# Altium project SVPXFMC_Carrier_6U.PrjPcb
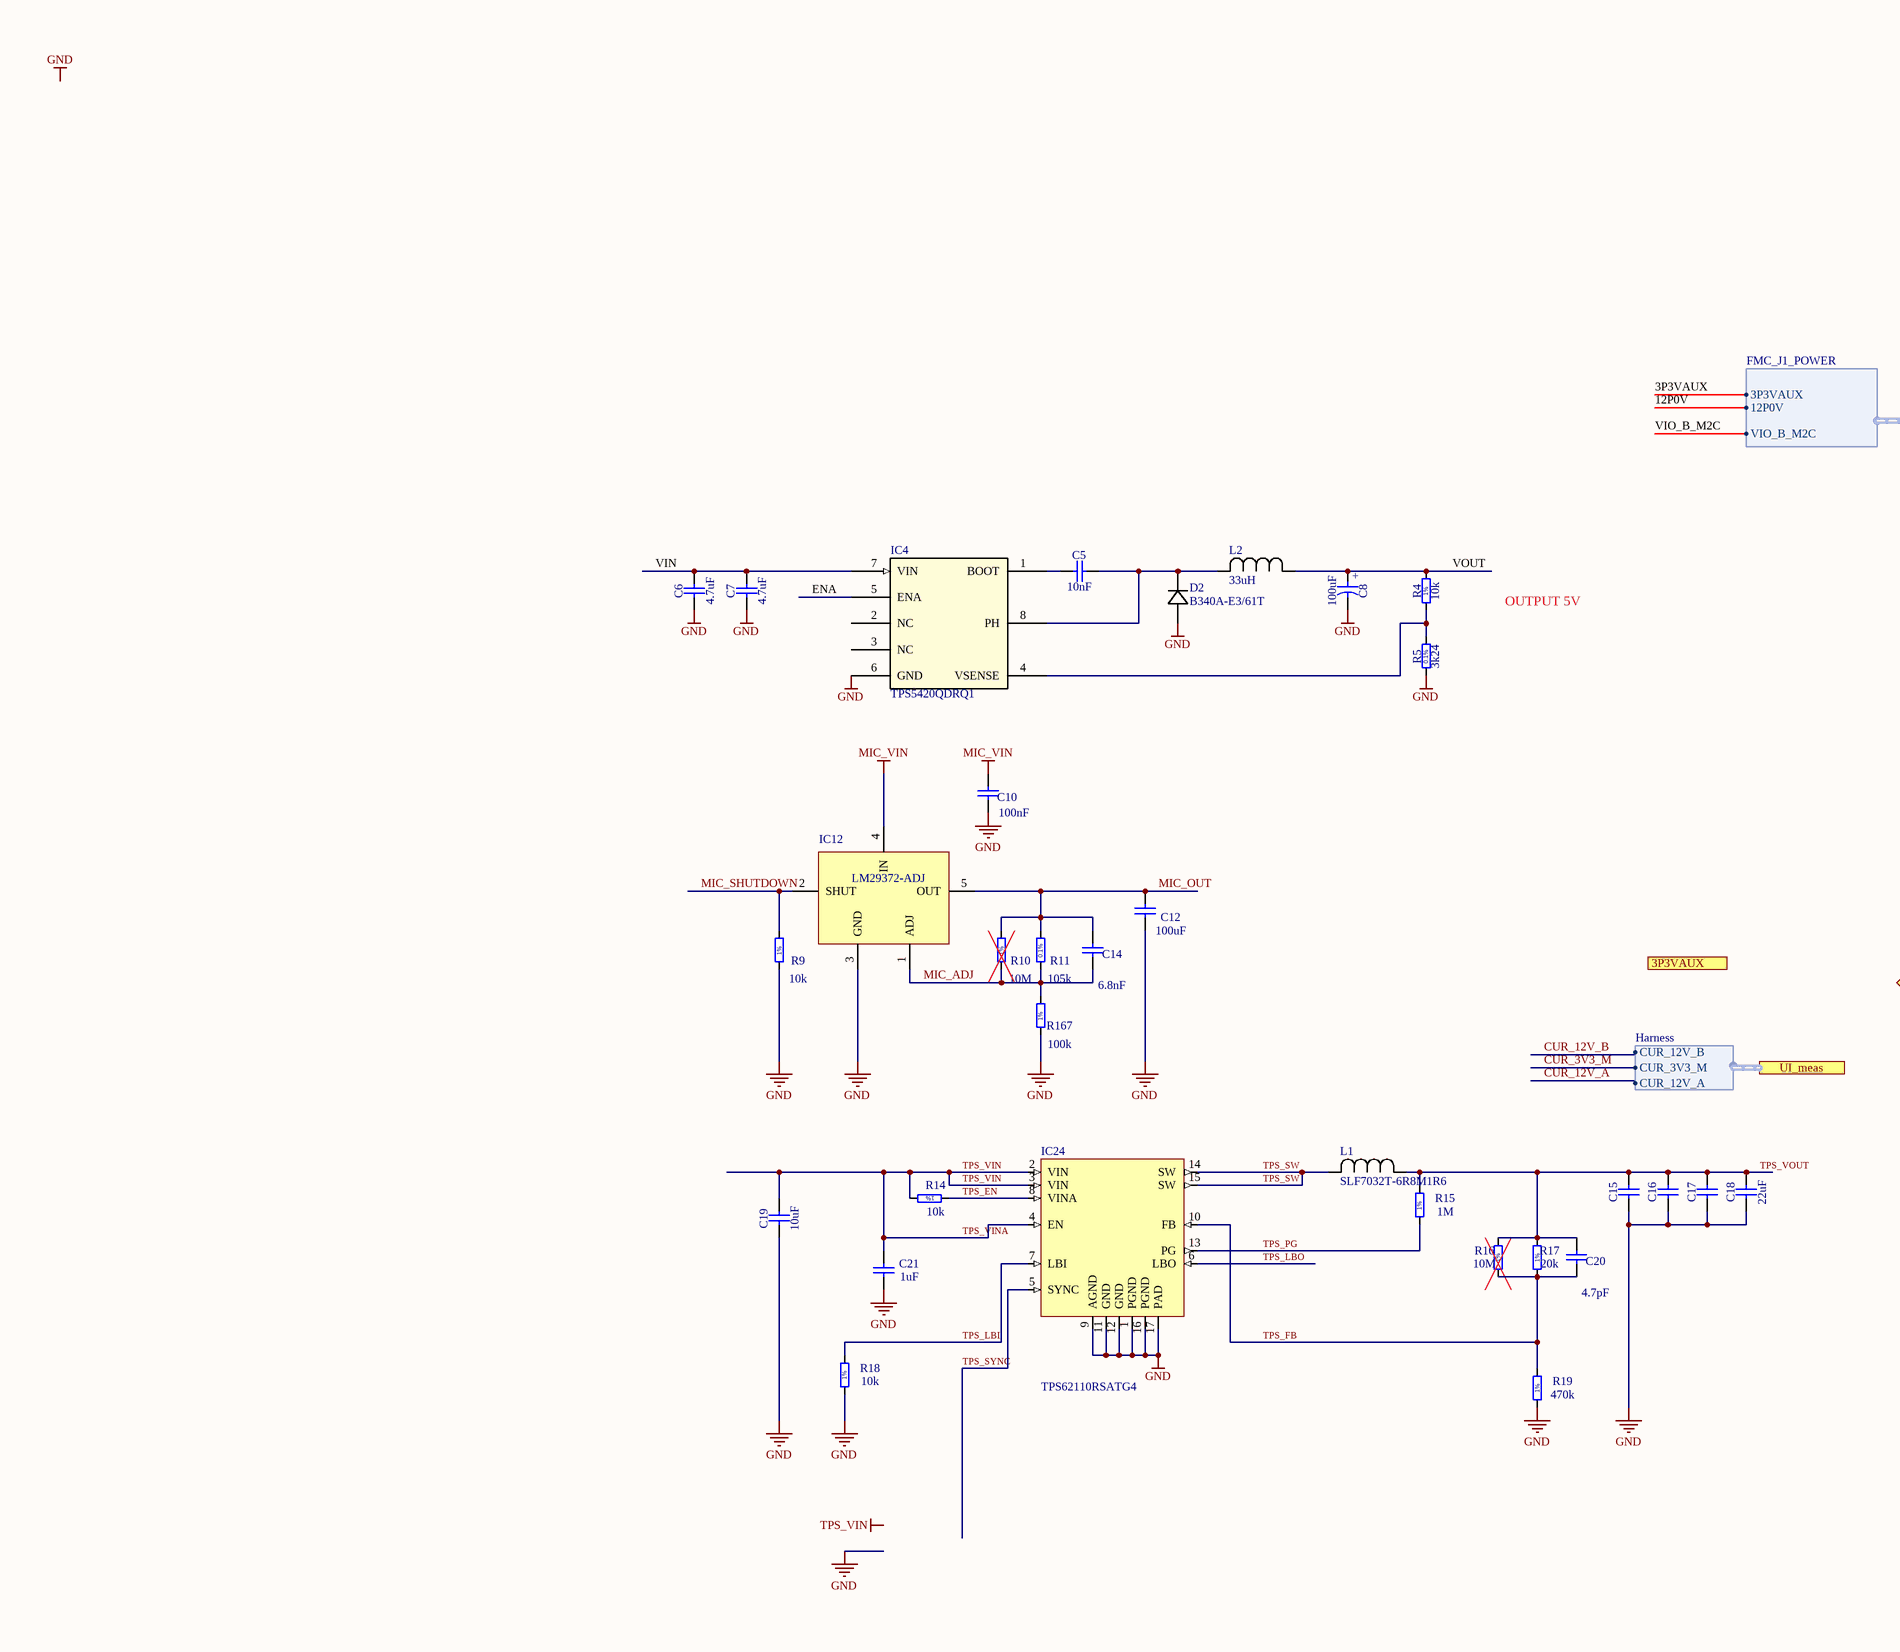
[diagram p0: Channel_supply.SchDoc, left]
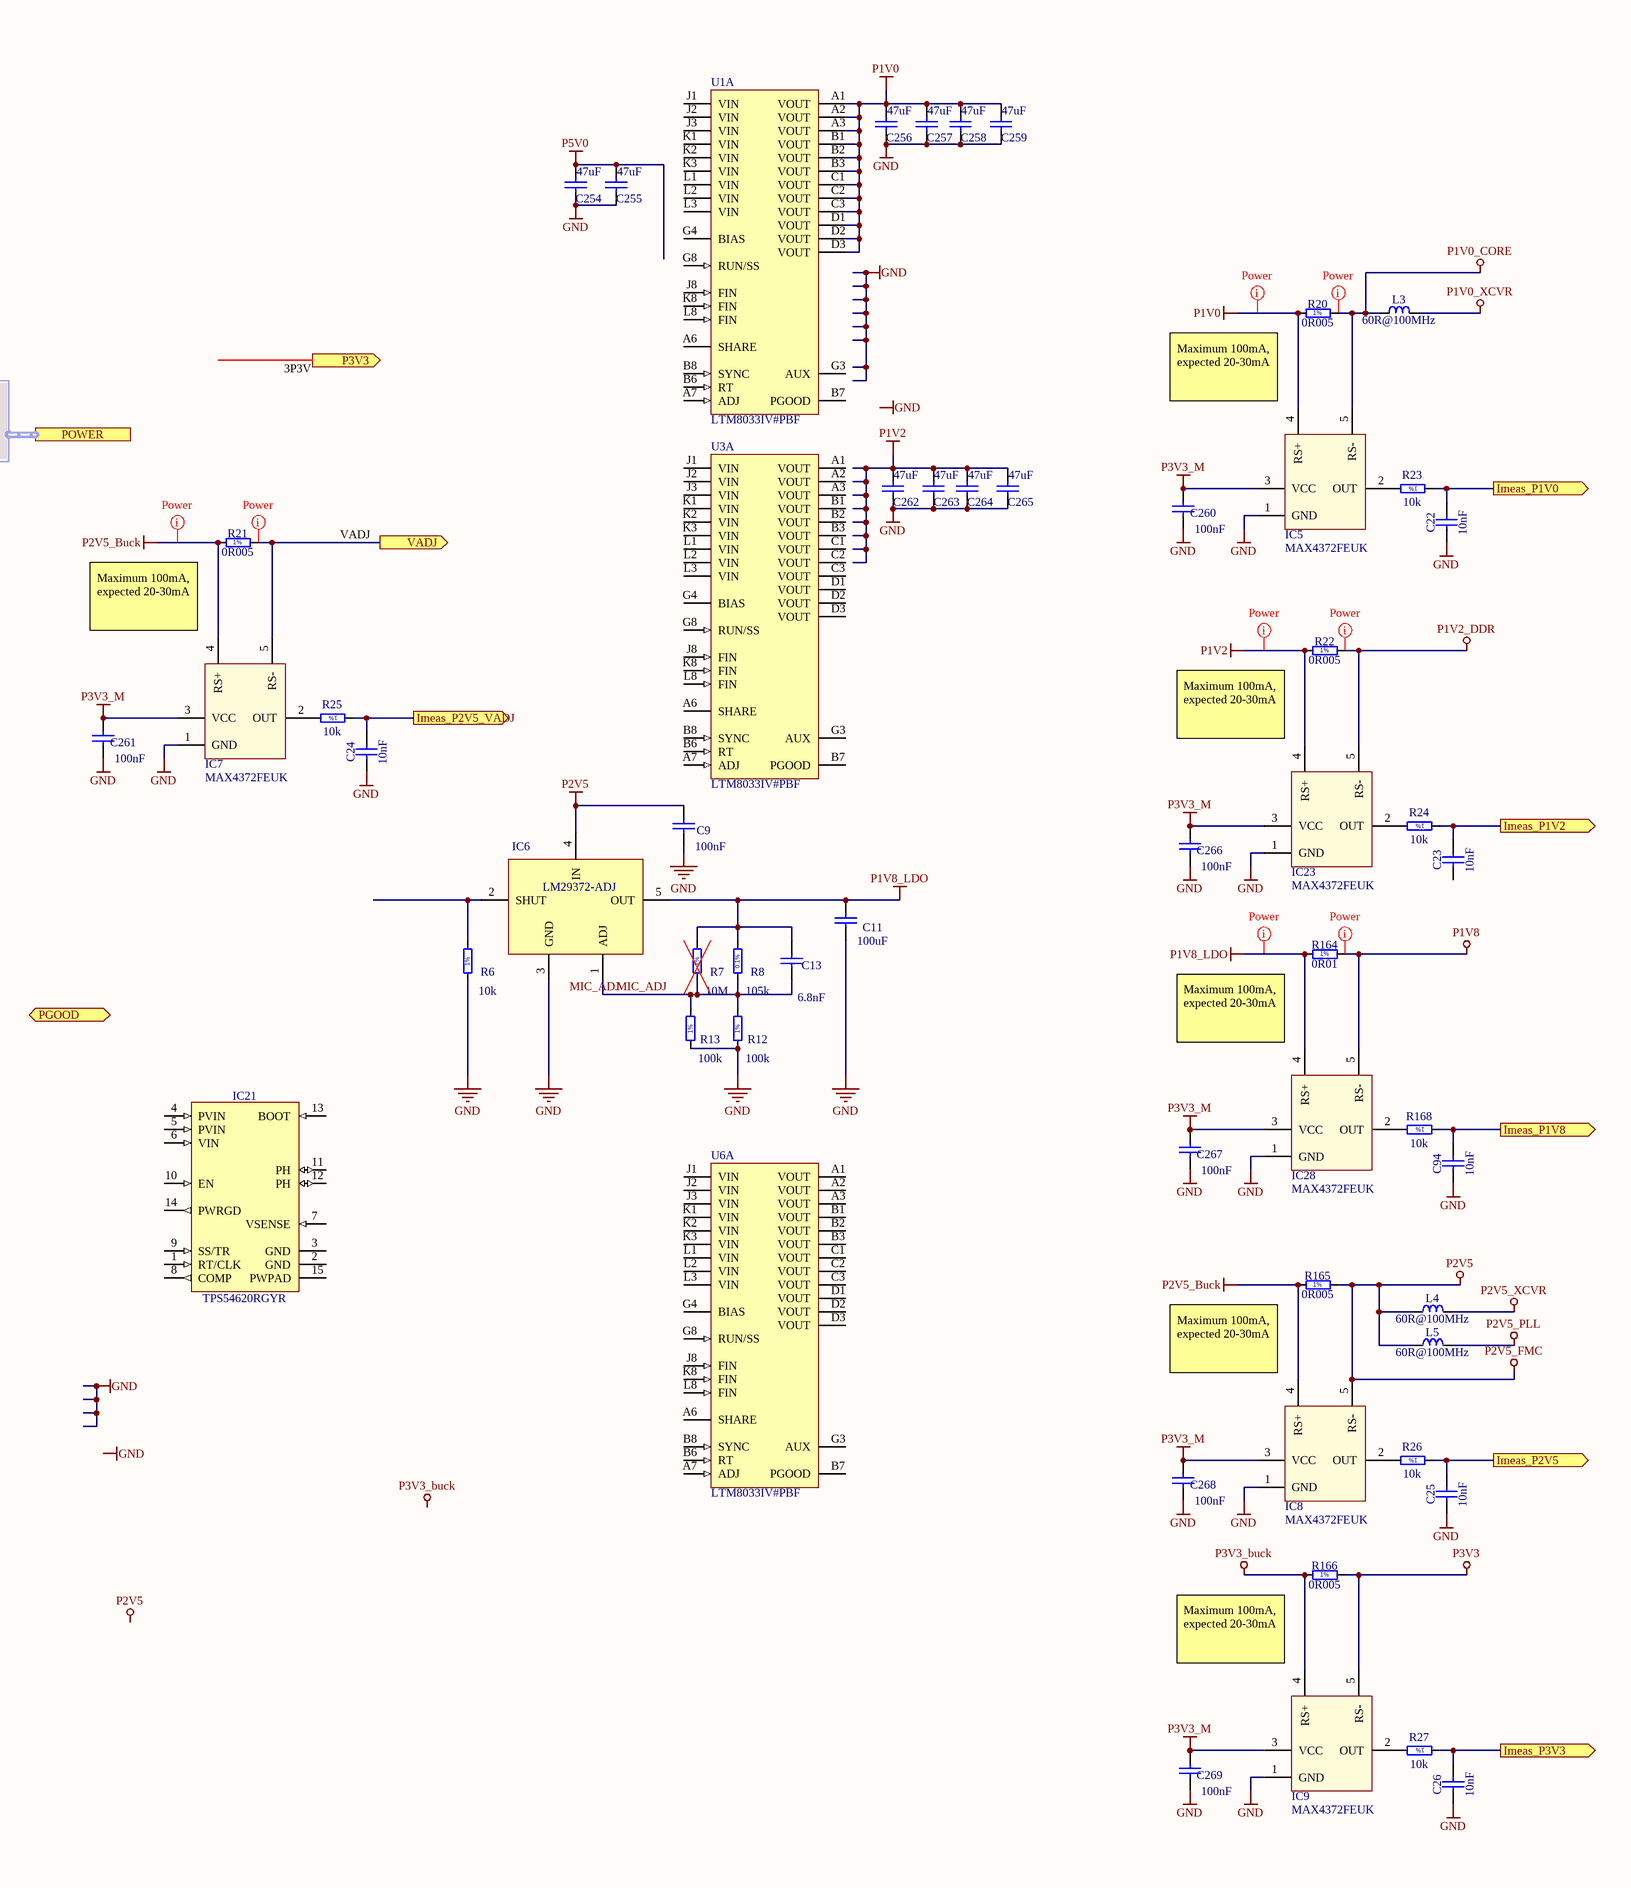
[diagram p1: Channel_supply.SchDoc, right]
ProjectAddress1: IBP Shanghai; ProjectAddress2: Level 3 - Building 3; ProjectAddress3: No.168 Linhong Road; ProjectAddress4: Shanghai 200335, China; ProjectOrganization: Altium; ProjectTitle: VPX 6U; Template Family: VPX; Template Notes: - Nominal values used, all dimensions are mm.  - Stackup is not specified in AV46DOT0.PDF, nor implemented in this template.  - The component height constraint is defined in AV46DOT0.pdf, page 90.; Template Revision Date: May 2011; Template Source Document: AV46DOT0.pdf; Template Source Name: ANSI/VITA 46.0-2007; Template Source Organization: VITA; Template Source Revision Date: Oct-2007; Template Source URL: www.vita.com
2 sheets, 98 parts. Net scope: flat (ports and power ports of the same name join across sheets).
Board file: SVPXFMC_Carrier_6U.PcbDoc
Sheets:
  Channel_supply.SchDoc
  FPGA_RGMII_Misc.SchDoc

## Sheet Channel_supply.SchDoc
size A2

### Parts
C5  10nF  [CAPC1608X87N]
C6  4.7uF  [CAPC3225X270N]
C7  4.7uF  [CAPC3225X270N]
C8  100uF  [CAPMP7343X310N]
C9  100nF  [CAPC1608X87N]
C10  100nF  [CAPC1608X87N]
C11  100uF  [CAPC3216X190N]
C12  100uF  [CAPC3216X190N]
C13  6.8nF  [CAPC1608X87N]
C14  6.8nF  [CAPC1608X87N]
C15  22uF  [CAPC3225X270N]  (value not drawn)
C16  22uF  [CAPC3225X270N]  (value not drawn)
C17  22uF  [CAPC3225X270N]  (value not drawn)
C18  22uF  [CAPC3225X270N]
C19  10uF  [CAPC3225X270N]
C20  4.7pF  [CAPC1608X87N]
C21  1uF  [CAPC1608X87N]
C22  10nF  [CAPC1608X87N]
C23  10nF  [CAPC1608X87N]
C24  10nF  [CAPC1608X87N]
C25  10nF  [CAPC1608X87N]
C26  10nF  [CAPC1608X87N]
C94  10nF  [CAPC1608X87N]
C254  47uF  [CAPC2012X140N]
C255  47uF  [CAPC2012X140N]
C256  47uF  [CAPC2012X140N]
C257  47uF  [CAPC2012X140N]
C258  47uF  [CAPC2012X140N]
C259  47uF  [CAPC2012X140N]
C260  100nF  [CAPC1608X87N]
C261  100nF  [CAPC1608X87N]
C262  47uF  [CAPC2012X140N]
C263  47uF  [CAPC2012X140N]
C264  47uF  [CAPC2012X140N]
C265  47uF  [CAPC2012X140N]
C266  100nF  [CAPC1608X87N]
C267  100nF  [CAPC1608X87N]
C268  100nF  [CAPC1608X87N]
C269  100nF  [CAPC1608X87N]
D2  B340A-E3/61T  [DO-214AC]
IC4  TPS5420QDRQ1  [SOIC D8]
IC5  MAX4372FEUK  [SOT95P270X145-5N]
IC6  LM29372-ADJ  [DPAK170P1524X460-6N]
IC7  MAX4372FEUK  [SOT95P270X145-5N]
IC8  MAX4372FEUK  [SOT95P270X145-5N]
IC9  MAX4372FEUK  [SOT95P270X145-5N]
IC12  LM29372-ADJ  [DPAK170P1524X460-6N]
IC21  TPS54620RGYR  [TEXAS_RGY (S-PVQFN-N14)]
IC23  MAX4372FEUK  [SOT95P270X145-5N]
IC24  TPS62110RSATG4  [QFN127P600-16]
IC28  MAX4372FEUK  [SOT95P270X145-5N]
L1  SLF7032T-6R8M1R6  [IND_7030]
L2  33uH  [IND_12x12]
L3  60R@100MHz  [INDC4516X180N]
L4  60R@100MHz  [INDC4516X180N]
L5  60R@100MHz  [INDC4516X180N]
R4  10k  [RESC1608X55N]
R5  3k24  [RESC1608X55N]
R6  10k  [RESC1608X55N]
R7  10M  [RESC1608X55N]
R8  105k  [RESC1608X55N]
R9  10k  [RESC1608X55N]
R10  10M  [RESC1608X55N]
R11  105k  [RESC1608X55N]
R12  100k  [RESC1608X55N]
R13  100k  [RESC1608X55N]
R14  10k  [RESC1608X55N]
R15  1M  [RESC1608X55N]
R16  10M  [RESC1608X55N]
R17  20k  [RESC1608X55N]
R18  10k  [RESC1608X55N]
R19  470k  [RESC1608X55N]
R20  0R005  [RESC3216X80N]
R21  0R005  [RESC3216X80N]
R22  0R005  [RESC3216X80N]
R23  10k  [RESC1608X55N]
R24  10k  [RESC1608X55N]
R25  10k  [RESC1608X55N]
R26  10k  [RESC1608X55N]
R27  10k  [RESC1608X55N]
R164  0R01  [RESC3216X80N]
R165  0R005  [RESC3216X80N]
R166  0R005  [RESC3216X80N]
R167  100k  [RESC1608X55N]
R168  10k  [RESC1608X55N]
U1  LTM8033IV#PBF  [LT-LGA-76-15000X11250X4320_V]  (part A of 2)
U3  LTM8033IV#PBF  [LT-LGA-76-15000X11250X4320_V]  (part A of 2)
U6  LTM8033IV#PBF  [LT-LGA-76-15000X11250X4320_V]  (part A of 2)

### Ports
3P3VAUX (out), Imeas_P1V0 (out), Imeas_P1V2 (out), Imeas_P1V8 (out), Imeas_P2V5 (out), Imeas_P2V5_VADJ (out), Imeas_P3V3 (out), P3V3 (out), PGOOD (bidir), POWER (harness FMC_J1_POWER), UI_meas (harness Harness), VADJ (out)

### Harnesses
FMC_J1_POWER: 3P3VAUX, 12P0V, VIO_B_M2C
Harness: CUR_12V_B, CUR_3V3_M, CUR_12V_A

### Nets
GND: C6.1 C7.1 C8.2 C9.1 C10.1 C11.1 C12.1 C15.1 C16.1 C17.1 C18.1 C19.1 C21.1 C22.1 C24.1 C25.1 C26.1 C94.1 C254.1 C255.1 C256.1 C257.1 C258.1 C259.1 C260.1 C261.1 C262.1 C263.1 C264.1 C265.1 C266.1 C267.1 C268.1 C269.1 D2.2 IC4.6(GND) IC5.1(GND) IC6.3(GND) IC7.1(GND) IC8.1(GND) IC9.1(GND) IC12.3(GND) IC23.1(GND) IC24.1(PGND) IC24.9(AGND) IC24.11(GND) IC24.12(GND) IC24.16(PGND) IC24.17(PAD) IC28.1(GND) R5.1 R6.1 R9.1 R12.1 R13.1 R18.1 R19.1 R167.1
MIC_VIN: C10.2 IC12.4(IN)
P1V0: C256.2 C257.2 C258.2 C259.2 IC5.4(RS+) R20.1 U1.A1(VOUT) U1.A2(VOUT) U1.A3(VOUT) U1.B1(VOUT) U1.B2(VOUT) U1.B3(VOUT) U1.C1(VOUT) U1.C2(VOUT) U1.C3(VOUT) U1.D1(VOUT) U1.D2(VOUT) U1.D3(VOUT)
P1V0_CORE: IC5.5(RS-) L3.1 R20.2
P1V0_XCVR: L3.2
P1V2: C262.2 C263.2 C264.2 C265.2 IC23.4(RS+) R22.1
P1V2_DDR: IC23.5(RS-) R22.2
P1V8: IC28.5(RS-) R164.2
P1V8_LDO: C11.2 C13.2 IC6.5(OUT) IC28.4(RS+) R7.2 R8.2 R164.1
P2V5: C9.2 IC6.4(IN) IC8.5(RS-) L4.1 L5.1 R165.2  [also labelled P2V5_FMC]
P2V5_Buck: IC7.4(RS+) IC8.4(RS+) R21.1 R165.1
P2V5_PLL: L5.2
P2V5_XCVR: L4.2
P3V3: IC9.5(RS-) R166.2
P3V3_buck: IC9.4(RS+) R166.1
P3V3_M: C260.2 C261.2 C266.2 C267.2 C268.2 C269.2 IC5.3(VCC) IC7.3(VCC) IC8.3(VCC) IC9.3(VCC) IC23.3(VCC) IC28.3(VCC)
P5V0: C254.2 C255.2
TPS_VIN: C19.2 C21.2 IC24.2(VIN) IC24.3(VIN) IC24.4(EN) R14.2  [also labelled TPS_VINA]
3P3V: port P3V3
3P3VAUX: port POWER.3P3VAUX
12P0V: port POWER.12P0V
CUR_3V3_M: harness Harness.CUR_3V3_M
ENA: IC4.5(ENA)
MIC_ADJ: C13.1 C14.1 IC6.1(ADJ) IC12.1(ADJ) R7.1 R8.1 R10.1 R11.1 R12.2 R13.2 R167.2
MIC_OUT: C12.2 C14.2 IC12.5(OUT) R10.2 R11.2
MIC_SHUTDOWN: IC12.2(SHUT) R9.2
TPS_EN: IC24.8(VINA) R14.1
TPS_FB: C20.1 IC24.10(FB) R16.1 R17.1 R19.2
TPS_LBI: IC24.7(LBI) R18.2
TPS_LBO: IC24.6(LBO)
TPS_PG: IC24.13(PG) R15.1
TPS_SW: IC24.14(SW) IC24.15(SW) L1.2
TPS_SYNC: IC24.5(SYNC)
TPS_VOUT: C15.2 C16.2 C17.2 C18.2 C20.2 L1.1 R15.2 R16.2 R17.2
VADJ: IC7.5(RS-) R21.2 ; port VADJ
VIN: C6.2 C7.2 IC4.7(VIN)
VIO_B_M2C: port POWER.VIO_B_M2C
VOUT: C8.1 L2.1 R4.2
NetC5_1: C5.1 IC4.1(BOOT)
NetC5_2: C5.2 D2.1 IC4.8(PH) L2.2
NetC22_2: C22.2 R23.1 ; port Imeas_P1V0
NetC23_2: C23.2 R24.1 ; port Imeas_P1V2
NetC24_2: C24.2 R25.1 ; port Imeas_P2V5_VADJ
NetC25_2: C25.2 R26.1 ; port Imeas_P2V5
NetC26_2: C26.2 R27.1 ; port Imeas_P3V3
NetC94_2: C94.2 R168.1 ; port Imeas_P1V8
NetIC4_4: IC4.4(VSENSE) R4.1 R5.2
NetIC5_2: IC5.2(OUT) R23.2
NetIC6_2: IC6.2(SHUT) R6.2
NetIC7_2: IC7.2(OUT) R25.2
NetIC8_2: IC8.2(OUT) R26.2
NetIC9_2: IC9.2(OUT) R27.2
NetIC23_2: IC23.2(OUT) R24.2
NetIC28_2: IC28.2(OUT) R168.2

Not connected (* = marked no-connect by the designer): C23 1; IC4 2(NC) 3(NC); IC21 1(RT/CLK) 2(GND) 3(GND) 4(PVIN) 5(PVIN) 6(VIN) 7(VSENSE) 8(COMP) 9(SS/TR) 10(EN) 11(PH) 12(PH) 13(BOOT) 14(PWRGD) 15(PWPAD); U1 A6(SHARE) A7(ADJ) B6(RT) B7(PGOOD) B8(SYNC) G3(AUX) G4(BIAS) G8(RUN/SS) J1(VIN) J2(VIN) J3(VIN) J8(FIN) K1(VIN) K2(VIN) K3(VIN) K8(FIN) L1(VIN) L2(VIN) L3(VIN) L8(FIN); U3 A1(VOUT) A2(VOUT) A3(VOUT) A6(SHARE) A7(ADJ) B1(VOUT) B2(VOUT) B3(VOUT) B6(RT) B7(PGOOD) B8(SYNC) C1(VOUT) C2(VOUT) C3(VOUT) D1(VOUT) D2(VOUT) D3(VOUT) G3(AUX) G4(BIAS) G8(RUN/SS) J1(VIN) J2(VIN) J3(VIN) J8(FIN) K1(VIN) K2(VIN) K3(VIN) K8(FIN) L1(VIN) L2(VIN) L3(VIN) L8(FIN); U6 A1(VOUT) A2(VOUT) A3(VOUT) A6(SHARE) A7(ADJ) B1(VOUT) B2(VOUT) B3(VOUT) B6(RT) B7(PGOOD) B8(SYNC) C1(VOUT) C2(VOUT) C3(VOUT) D1(VOUT) D2(VOUT) D3(VOUT) G3(AUX) G4(BIAS) G8(RUN/SS) J1(VIN) J2(VIN) J3(VIN) J8(FIN) K1(VIN) K2(VIN) K3(VIN) K8(FIN) L1(VIN) L2(VIN) L3(VIN) L8(FIN)

### Layout directives
net class Power: P1V0, P1V0_CORE, P1V2, P1V2_DDR, P1V8, P1V8_LDO, P2V5_Buck, VADJ

### Notes on the sheet
- Maximum 100mA, expected 20-30mA
- OUTPUT 5V
- Labels drawn without touching a wire or pin: GND, MIC_ADJ, P2V5, P3V3_buck, TPS_VIN
- (in symbol CTE7343-31_100UF_10V_10%_LESR0050) +
- (in symbol R0603_1M_1%_0.1W_100PPM) 1%
- (in symbol R0603_3K24_0.1%_0.063W_10PPM) 0.1%
- (in symbol R0603_10K_1%_0.1W_100PPM) 1%
- (in symbol R0603_10M_1%_0.1W_100PPM) 1%
- (in symbol R0603_20K_1%_0.1W_100PPM) 1%
- (in symbol R0603_100K_1%_0.1W_100PPM) 1%
- (in symbol R0603_105K_0.1%_0.063W_10PPM) 0.1%
- (in symbol R0603_470K_1%_0.1W_100PPM) 1%
- (in symbol R1206_0R01_1%_1W_100PPM_TT_LRMAM1206) 1%
- (in symbol R1206_0R005_1%_1W_100PPM_TT_LRMAM1206) 1%

### Library data of the parts
C5 C22-C26 C94 = CC0603_10NF_50V_10%_X7R: Non-polarised capacitor; Part Description: SMD Multilayer Chip Ceramic Capacitor; Manufacturer: GENERIC; Manufacturer1 Part Number: 223858615636; Voltage: 50V; TC: X7R; Tolerance: ±10%; Part Number: CC0603_10NF_50V_10%_X7R; Component Kind: Standard; Component Type: Standard; Pin Count: 2; Value: 10nF; Status: Preferred; Manufacturer Part Number: CC0603_10NF_50V_10%_X7R; Case: 0603; Mounted: Yes; Socket: No; SMD: Yes; Sense: No; Manufacturer1 Example: PHYCOMP; Manufacturer1 ComponentHeight: 0.87mm; HelpURL: \\cern.ch\dfs\Applications\Altium\Datasheets\CC0603_X7R_PHYCOMP.pdf; Author: CERN DEM JLC
  C5: CreateDate: 2007-12-03; LatestRevisionDate: 2007-12-03
  C22-C26 C94: CreateDate: 03.12.2007; LatestRevisionDate: 03.12.2007
C6 C7 = CC1210_4.7UF_50V_10%_X7R: Non-polarised capacitor; Part Description: SMD Multilayer Chip Ceramic Capacitor; Manufacturer: GENERIC; Manufacturer1 Part Number: C1210C475K5RAC; Voltage: 50V; TC: X7R; Tolerance: ±10%; Part Number: CC1210_4.7UF_50V_10%_X7R; Component Kind: Standard; Component Type: Standard; Pin Count: 2; Value: 4.7uF; Status: None; Manufacturer Part Number: CC1210_4.7UF_50V_10%_X7R; Case: 1210; Mounted: Yes; Socket: No; SMD: Yes; Sense: No; Manufacturer1 Example: KEMET; Manufacturer1 ComponentHeight: 2.7mm; HelpURL: \\cern.ch\dfs\Applications\Altium\Datasheets\CC1210_X7R_KEMET.pdf; Author: CERN DEM JLC; CreateDate: 2009-04-01; LatestRevisionDate: 2009-05-05
C8 = CTE7343-31_100UF_10V_10%_LESR0050: Polarised capacitor; Part Number: 100uF 2917 20% ESR=80mOhms AEC-Q200; Part Description: Low ESR 0R080  Tantalum Capacitor; Manufacturer: GENERIC; Manufacturer Part Number: T598D107M010ATE080; Voltage: 10V; Tolerance: ±10%; Component Kind: Standard; Component Type: Standard; Pin Count: 2; Value: 100uF; Status: Preferred; Case: D; Mounted: Yes; Socket: No; SMD: Yes; Sense: No; Manufacturer1 Example: AVX; Manufacturer1 Part Number: T598D107M010ATE080; Manufacturer1 ComponentHeight: 3.1mm; HelpURL: \\cern.ch\dfs\Applications\Altium\Datasheets\CTE-LESR_AVX_TPS.pdf; Author: CERN DEM JLC; CreateDate: 2008-05-05; LatestRevisionDate: 2009-01-20
C9 C10 C260 C261 C266-C269 = CC0603_100NF_50V_10%_X7R: Non-polarised capacitor; Part Description: SMD Multilayer Chip Ceramic Capacitor; Manufacturer: GENERIC; Manufacturer1 Part Number: 223858615649; Voltage: 50V; TC: X7R; Tolerance: ±10%; Part Number: CC0603_100NF_50V_10%_X7R; Component Kind: Standard; Component Type: Standard; Pin Count: 2; Value: 100nF; Status: Preferred; Manufacturer Part Number: CC0603_100NF_50V_10%_X7R; Case: 0603; Mounted: Yes; Socket: No; SMD: Yes; Sense: No; Manufacturer1 Example: PHYCOMP; Manufacturer1 ComponentHeight: 0.87mm; HelpURL: \\cern.ch\dfs\Applications\Altium\Datasheets\CC0603_X7R_PHYCOMP.pdf; Author: CERN DEM JLC; CreateDate: 2007-12-03; LatestRevisionDate: 2007-12-03
C11 C12 = CC1206_100UF_10V_20%_X5R: Non-polarised capacitor; Part Description: SMD Multilayer Chip Ceramic Capacitor; Manufacturer: GENERIC; Manufacturer1 Part Number: C3216X5R1A107M160AC; Voltage: 10V; TC: X5R; Tolerance: ±20%; Part Number: CC1206_100UF_10V_20%_X5R; Component Kind: Standard; Component Type: Standard; Pin Count: 2; Value: 100uF; Status: None; Manufacturer Part Number: CC1206_100UF_10V_20%_X5R; Case: 1206; Mounted: Yes; Socket: No; SMD: Yes; Sense: No; Manufacturer1 Example: TDK; Manufacturer1 ComponentHeight: 1.9mm; HelpURL: \\cern.ch\dfs\Applications\Altium\Datasheets\CC1206_X5R_TDK_C.pdf; Author: CERN DEM MR; CreateDate: 2017-03-14; LatestRevisionDate: 2017-03-14
C13 C14 = CC0603_6.8NF_50V_5%_X7R: Non-polarised capacitor; Part Description: SMD Multilayer Chip Ceramic Capacitor; Manufacturer: GENERIC; Manufacturer1 Part Number: 223858615634; Voltage: 50V; TC: X7R; Tolerance: ±5%; Part Number: CC0603_6.8NF_50V_5%_X7R; Component Kind: Standard; Component Type: Standard; Pin Count: 2; Value: 6.8nF; Status: Preferred; Manufacturer Part Number: CC0603_6.8NF_50V_5%_X7R; Case: 0603; Mounted: Yes; Socket: No; SMD: Yes; Sense: No; Manufacturer1 Example: PHYCOMP; Manufacturer1 ComponentHeight: 0.87mm; HelpURL: \\cern.ch\dfs\Applications\Altium\Datasheets\CC0603_X7R_PHYCOMP.pdf; Author: CERN DEM JLC; CreateDate: 2007-12-03; LatestRevisionDate: 2007-12-03
C15-C18 = CC1210_22UF_16V_10%_X7R_YUDEN_EMK325B7226KMH: Non-polarised capacitor; Part Description: SMD Multilayer Chip Ceramic Capacitor (Automotive Grade); Manufacturer: TAIYO YUDEN; Voltage: 16V; TC: X7R; Tolerance: ±10%; Part Number: CC1210_22UF_16V_10%_X7R_YUDEN_EMK325B7226KMH; Component Kind: Standard; Component Type: Standard; Pin Count: 2; Value: 22uF; Status: Not Recommended; Manufacturer Part Number: EMK325B7226KMH; Case: 1210; Mounted: Yes; Socket: No; SMD: Yes; Sense: No; ComponentHeight: 2.7mm; HelpURL: \\cern.ch\dfs\Applications\Altium\Datasheets\CC1210_TAIYO-YUDEN_EMK325B7226KMH.pdf; Author: CERN DEM BC; CreateDate: 2016-02-29; LatestRevisionDate: 2016-02-29
C19 = CC1210_10UF_25V_10%_X7R: Non-polarised capacitor; Part Description: SMD Multilayer Chip Ceramic Capacitor; Manufacturer: GENERIC; Manufacturer1 Part Number: C1210C106K4RACTU; Voltage: 25V; TC: X7R; Tolerance: ±10%; Part Number: CC1210_10UF_25V_10%_X7R; Component Kind: Standard; Component Type: Standard; Pin Count: 2; Value: 10uF; Status: None; Manufacturer Part Number: CC1210_10UF_25V_10%_X7R; Case: 1210; Mounted: Yes; Socket: No; SMD: Yes; Sense: No; Manufacturer1 Example: KEMET; Manufacturer1 ComponentHeight: 2.7mm; HelpURL: \\cern.ch\dfs\Applications\Altium\Datasheets\CC1210_X7R_KEMET.pdf; Author: CERN DEM JLC; CreateDate: 2009-05-05; LatestRevisionDate: 2010-04-01
C20 = CC0603_4.7PF_50V_0.25PF_NP0: Non-polarised capacitor; Part Description: SMD Multilayer Chip Ceramic Capacitor; Manufacturer: GENERIC; Manufacturer1 Part Number: 223886715478; Voltage: 50V; TC: C0G/NP0; Tolerance: ±0.25pF; Part Number: CC0603_4.7PF_50V_0.25PF_NP0; Component Kind: Standard; Component Type: Standard; Pin Count: 2; Value: 4.7pF; Status: Preferred; Manufacturer Part Number: CC0603_4.7PF_50V_0.25PF_NP0; Case: 0603; Mounted: Yes; Socket: No; SMD: Yes; Sense: No; Manufacturer1 Example: PHYCOMP; Manufacturer1 ComponentHeight: 0.87mm; HelpURL: \\cern.ch\dfs\Applications\Altium\Datasheets\CC0603_NP0_PHYCOMP.pdf; Author: CERN DEM JLC; CreateDate: 2007-12-03; LatestRevisionDate: 2007-12-03
C21 = CC0603_1UF_25V_10%_X7R: Non-polarised capacitor; Part Description: SMD Multilayer Chip Ceramic Capacitor; Manufacturer: GENERIC; Manufacturer1 Part Number: GRM188R71E105KA12D; Voltage: 25V; TC: X7R; Tolerance: ±10%; Part Number: CC0603_1UF_25V_10%_X7R; Component Kind: Standard; Component Type: Standard; Pin Count: 2; Value: 1uF; Status: None; Manufacturer Part Number: CC0603_1UF_25V_10%_X7R; Case: 0603; Mounted: Yes; Socket: No; SMD: Yes; Sense: No; Manufacturer1 Example: MURATA; Manufacturer1 ComponentHeight: 0.9mm; HelpURL: \\cern.ch\dfs\Applications\Altium\Datasheets\CC0603_X7R_MURATA.pdf; Author: CERN DEM JLC; CreateDate: 2011-01-18; LatestRevisionDate: 2011-01-18
C254-C259 C262-C265 = CC0805_47UF_6.3V_20%_X5R: Non-polarised capacitor; Manufacturer: GENERIC; Part Description: SMD Multilayer Chip Ceramic Capacitor; Manufacturer1 Part Number: C0805C476M9PACTU; Voltage: 6.3V; TC: X5R; Tolerance: ±20%; Part Number: CC0805_47UF_6.3V_20%_X5R; Component Kind: Standard; Component Type: Standard; Pin Count: 2; Value: 47uF; Status: Preferred; Manufacturer Part Number: CC0805_47UF_6.3V_20%_X5R; Case: 0805; Mounted: Yes; Socket: No; SMD: Yes; Sense: No; Manufacturer1 Example: KEMET; Manufacturer1 ComponentHeight: 1.4mm; HelpURL: \\cern.ch\dfs\Applications\Altium\Datasheets\CC0805_X5R_KEMET.pdf; Author: CERN DEM JLC; CreateDate: 16/10/2012; LatestRevisionDate: 16/10/2012
D2 = D_B340A-E3/61T: Diode Schottky 3A/40V; Manufacturer: Vishay; Bonding: No; PressFit: No; Case: *; Component Kind: Standard; Component Type: Standard; ComponentHeigth: *; CreateDate: 2018-01-01; Device: B340A-E3/61T; Footprint: *; HelpURL: *; LatestRevisionDate: 2018-01-01; Manufacturer Part Number: B340A-E3/61T; Mounted: Yes; PackageDescription: *; Part Description: *; Part Number: B340A-E3/61T; Pin Count: *; Sense: No; SMD: Yes; Socket: No; Value: *
IC4 = PM_TPS5420QDRQ1: Buck converter; Manufacturer: TI; Bonding: No; PressFit: No; Case: *; Component Kind: Standard; Component Type: Standard; ComponentHeigth: *; CreateDate: 2018-01-01; Device: TPS5420QDRQ1; Footprint: *; HelpURL: *; LatestRevisionDate: 2018-01-01; Manufacturer Part Number: TPS5420QDRQ1; Mounted: Yes; PackageDescription: *; Part Description: *; Part Number: TPS5420QDRQ1; Pin Count: *; Sense: No; SMD: Yes; Socket: No; Value: *
IC5 IC7-IC9 IC23 IC28 = PM_MAX4372FEUK: Manufacturer: Maxim; Part Description: High side current sense amplifier (x50); Bonding: No; PressFit: No; Case: SOT23-5; Component Kind: Standard; Component Type: Standard; ComponentHeigth: *; CreateDate: 2018-01-01; Device: MAX4372FEUK; Footprint: SOT23-5; HelpURL: *; LatestRevisionDate: 2018-01-01; Manufacturer Part Number: MAX4372FEUK; Mounted: Yes; PackageDescription: SOT23-5; Part Number: MAX4372FEUK; Pin Count: 5; Sense: No; SMD: Yes; Socket: No; Value: MAX4372FEUK
IC6 = REG_MIC29372: LDO 750mA ADJ; Part Description: ADJ 750mA Low Dropout Regulator; Manufacturer: MICREL - MICROCHIP; Manufacturer Part Number: MIC29372BU/BT; PressFit: No; Bonding: No; Part Number: LM29372; Component Kind: Standard; Component Type: Standard; Device: LM29372-ADJ; PackageDescription: TO-263-5; Pin Count: 5; Case: TO-263-5; Mounted: Yes; Socket: No; SMD: Yes; Sense: No; ComponentHeight: 4.6mm; Author: DKaczmara; CreateDate: 2018-01-26; LatestRevisionDate: 2018-01-26
IC12 = LM29372: LDO 750mA ADJ; Part Description: ADJ 750mA Low Dropout Regulator; Manufacturer: MICREL - MICROCHIP; Manufacturer Part Number: MIC29372BU/BT; PressFit: No; Bonding: No; Part Number: LM29372; Component Kind: Standard; Component Type: Standard; Device: LM29372-ADJ; PackageDescription: TO-263-5; Pin Count: 5; Case: TO-263-5; Mounted: Yes; Socket: No; SMD: Yes; Sense: No; ComponentHeight: 4.6mm; Author: DKaczmara; CreateDate: 2018-01-26; LatestRevisionDate: 2018-01-26
IC21 = TPS54620RGYR: 17V Input, 6A Output, Synchronous Step Down Switcher; Part Description: 4.5V-17V to 0.8V-16V, 6A Output, Synchronous Step Down Switcher; Manufacturer: TEXAS INSTRUMENTS; PressFit: No; Bonding: No; Part Number: TPS54620RGYR; Component Kind: Standard; Component Type: Standard; Device: TPS54620RGYR; PackageDescription: PSON, JEDEC MO-241BA, TEXAS RGY (S-PVQFN–N14), 0.50mm Pitch, Square; 5 Pin X 4 Pin, 3.5mm X 3.5mm X 1.00mm H body (w/thermal tab 2.05 X 2.05mm); Manufacturer Part Number: TPS54620RGYR; Pin Count: 15; Case: QFN14; Mounted: Yes; Socket: No; SMD: Yes; Sense: No; ComponentHeight: 1mm; HelpURL: \\cern.ch\dfs\Applications\Altium\Datasheets\TPS54620RGYR.pdf; Author: CERN DEM JLC; CreateDate: 28/10/2009; LatestRevisionDate: 06/11/2013
IC24 = PM_TPS62110
L1 = L_SLF7032T-6R8M1R6: Imported; Manufacturer_Part_Number: SLF7032T-6R8M1R6-2; Vendor: TDK; Built_By: EMA_UL_Team; C: Copyright (C) 2015 Accelerated Designs. All rights reserved; Value: Value
L2 = L_POW_MSS1260-333MLD: Manufacturer: Coilcraft; Bonding: No; ComponentHeigth: 6.2mm; PressFit: No; Case: *; Component Kind: Standard; Component Type: Standard; CreateDate: 2018-03-29; Footprint: *; HelpURL: *; LatestRevisionDate: 2018-03-29; Manufacturer Part Number: MSS1260-333MLD; Mounted: Yes; PackageDescription: 12.3mm x 12.3mm; Part Description: MSS1260-333MLD; Part Number: MSS1260-333MLD; Pin Count: 2; Sense: No; SMD: Yes; Socket: No; Value: 33uH
L3-L5 = IND1806_MURATA_BLM41PG600SN1L: Inductor; Part Description: SMD EMI Suppression Chip Ferrite Bead (BLM41P Series); Manufacturer: MURATA; Power: 6A; Resistance: 0.01R; Part Number: IND1806_MURATA_BLM41PG600SN1L; Component Kind: Standard; Component Type: Standard; Pin Count: 2; Value: 60R@100MHz; Status: None; Manufacturer Part Number: BLM41PG600SN1L; Case: 1806; Mounted: Yes; Socket: No; SMD: Yes; Sense: No; ComponentHeight: 1.8mm; HelpURL: \\cern.ch\dfs\Applications\Altium\Datasheets\IND1806_MURATA_BLM41P.pdf; Author: CERN DEM JLC; CreateDate: 02/12/2009; LatestRevisionDate: 02/12/2009
R4 R6 R9 R14 R18 R23-R27 R168 = R0603_10K_1%_0.1W_100PPM: Resistor - 1%; Part Description: General Purpose Thick Film Chip Resistor; Manufacturer: GENERIC; Manufacturer1 Part Number: NRC06F1002TRF; Power: 0.1W; TC: ±100ppm/°C; PressFit: No; Part Number: R0603_10K_1%_0.1W_100PPM; Component Kind: Standard; Component Type: Standard; Pin Count: 2; Value: 10k; Status: Preferred; Tolerance: ±1%; Manufacturer Part Number: R0603_10K_1%_0.1W_100PPM; Case: 0603; Mounted: Yes; Sense: No; Socket: No; SMD: Yes; Manufacturer1 Example: NIC COMPONENT; Manufacturer1 ComponentHeight: 0.55mm; HelpURL: \\cern.ch\dfs\Applications\Altium\Datasheets\R0603_NIC_NRC.pdf; Author: CERN DEM JLC; CreateDate: 2007-12-03; LatestRevisionDate: 2008-03-13
R5 = R0603_3K24_0.1%_0.063W_10PPM: Resistor - 0.1%; Part Description: Thin Film Chip Resistor; Manufacturer: GENERIC; Manufacturer1 Part Number: RN73C1J3K24BTDF; Power: 0.063W; TC: ±10ppm; PressFit: No; Part Number: R0603_3K24_0.1%_0.063W_10PPM; Component Kind: Standard; Component Type: Standard; Pin Count: 2; Value: 3k24; Status: Not Recommended; Tolerance: ±0.1%; Manufacturer Part Number: R0603_3K24_0.1%_0.063W_10PPM; Case: 0603; Mounted: Yes; Sense: No; Socket: No; SMD: Yes; Manufacturer1 Example: TYCO HOLSWORTHY; Manufacturer1 ComponentHeight: 0.5mm; HelpURL: \\cern.ch\dfs\Applications\Altium\Datasheets\R0603_Tyco_RN73.pdf; Author: CERN DEM JLC; CreateDate: 2007-12-03; LatestRevisionDate: 2008-03-13
R7 R10 R16 = R0603_10M_1%_0.1W_100PPM: Resistor - 1%; Part Description: General Purpose Thick Film Chip Resistor; Manufacturer: GENERIC; Manufacturer1 Part Number: CRCW060310M0FKEA; Power: 0.1W; TC: ±100ppm/°C; PressFit: No; Part Number: R0603_10M_1%_0.1W_100PPM; Component Kind: Standard; Component Type: Standard; Pin Count: 2; Value: 10M; Status: Preferred; Tolerance: ±1%; Manufacturer Part Number: R0603_10M_1%_0.1W_100PPM; Case: 0603; Mounted: Yes; Sense: No; Socket: No; SMD: Yes; Manufacturer1 Example: VISHAY; Manufacturer1 ComponentHeight: 0.55mm; HelpURL: \\cern.ch\dfs\Applications\Altium\Datasheets\R0603_VISHAY_CRCW e3.pdf; Author: CERN DEM JLC; CreateDate: 2017-01-12; LatestRevisionDate: 2017-01-12
R8 R11 = R0603_105K_0.1%_0.063W_10PPM: Resistor - 0.1%; Part Description: Thin Film Chip Resistor; Manufacturer: GENERIC; Manufacturer1 Part Number: RN73C1J105KBTDF; Power: 0.063W; TC: ±10ppm; PressFit: No; Part Number: R0603_105K_0.1%_0.063W_10PPM; Component Kind: Standard; Component Type: Standard; Pin Count: 2; Value: 105k; Status: Not Recommended; Tolerance: ±0.1%; Manufacturer Part Number: R0603_105K_0.1%_0.063W_10PPM; Case: 0603; Mounted: Yes; Sense: No; Socket: No; SMD: Yes; Manufacturer1 Example: TYCO HOLSWORTHY; Manufacturer1 ComponentHeight: 0.5mm; HelpURL: \\cern.ch\dfs\Applications\Altium\Datasheets\R0603_Tyco_RN73.pdf; Author: CERN DEM JLC; CreateDate: 2007-12-03; LatestRevisionDate: 2008-03-13
R12 R13 R167 = R0603_100K_1%_0.1W_100PPM: Resistor - 1%; Part Description: General Purpose Thick Film Chip Resistor; Manufacturer: GENERIC; Manufacturer1 Part Number: NRC06F1003TRF; Power: 0.1W; TC: ±100ppm/°C; PressFit: No; Part Number: R0603_100K_1%_0.1W_100PPM; Component Kind: Standard; Component Type: Standard; Pin Count: 2; Value: 100k; Status: Preferred; Tolerance: ±1%; Manufacturer Part Number: R0603_100K_1%_0.1W_100PPM; Case: 0603; Mounted: Yes; Sense: No; Socket: No; SMD: Yes; Manufacturer1 Example: NIC COMPONENT; Manufacturer1 ComponentHeight: 0.55mm; HelpURL: \\cern.ch\dfs\Applications\Altium\Datasheets\R0603_NIC_NRC.pdf; Author: CERN DEM JLC; CreateDate: 2007-12-03; LatestRevisionDate: 2008-03-13
R15 = R0603_1M_1%_0.1W_100PPM: Resistor - 1%; Part Description: General Purpose Thick Film Chip Resistor; Manufacturer: GENERIC; Manufacturer1 Part Number: NRC06F1004TRF; Power: 0.1W; TC: ±100ppm/°C; PressFit: No; Part Number: R0603_1M_1%_0.1W_100PPM; Component Kind: Standard; Component Type: Standard; Pin Count: 2; Value: 1M; Status: Preferred; Tolerance: ±1%; Manufacturer Part Number: R0603_1M_1%_0.1W_100PPM; Case: 0603; Mounted: Yes; Sense: No; Socket: No; SMD: Yes; Manufacturer1 Example: NIC COMPONENT; Manufacturer1 ComponentHeight: 0.55mm; HelpURL: \\cern.ch\dfs\Applications\Altium\Datasheets\R0603_NIC_NRC.pdf; Author: CERN DEM JLC; CreateDate: 2007-12-03; LatestRevisionDate: 2008-03-13
R17 = R0603_20K_1%_0.1W_100PPM: Resistor - 1%; Part Description: General Purpose Thick Film Chip Resistor; Manufacturer: GENERIC; Manufacturer1 Part Number: NRC06F2002TRF; Power: 0.1W; TC: ±100ppm/°C; PressFit: No; Part Number: R0603_20K_1%_0.1W_100PPM; Component Kind: Standard; Component Type: Standard; Pin Count: 2; Value: 20k; Status: Preferred; Tolerance: ±1%; Manufacturer Part Number: R0603_20K_1%_0.1W_100PPM; Case: 0603; Mounted: Yes; Sense: No; Socket: No; SMD: Yes; Manufacturer1 Example: NIC COMPONENT; Manufacturer1 ComponentHeight: 0.55mm; HelpURL: \\cern.ch\dfs\Applications\Altium\Datasheets\R0603_NIC_NRC.pdf; Author: CERN DEM JLC; CreateDate: 2007-12-03; LatestRevisionDate: 2008-03-13
R19 = R0603_470K_1%_0.1W_100PPM: Resistor - 1%; Part Description: General Purpose Thick Film Chip Resistor; Manufacturer: GENERIC; Manufacturer1 Part Number: NRC06F4703TRF; Power: 0.1W; TC: ±100ppm/°C; PressFit: No; Part Number: R0603_470K_1%_0.1W_100PPM; Component Kind: Standard; Component Type: Standard; Pin Count: 2; Value: 470k; Status: Preferred; Tolerance: ±1%; Manufacturer Part Number: R0603_470K_1%_0.1W_100PPM; Case: 0603; Mounted: Yes; Sense: No; Socket: No; SMD: Yes; Manufacturer1 Example: NIC COMPONENT; Manufacturer1 ComponentHeight: 0.55mm; HelpURL: \\cern.ch\dfs\Applications\Altium\Datasheets\R0603_NIC_NRC.pdf; Author: CERN DEM JLC; CreateDate: 2007-12-03; LatestRevisionDate: 2008-03-13
R20-R22 R165 R166 = R1206_0R005_1%_1W_100PPM_TT_LRMAM1206: Resistor - 1%; Part Description: Low Value Metal Alloy Resistor; Manufacturer: TT Electronics; Manufacturer Part Number: LRMAM1206-R005FT5; Power: 1W; TC: ±100ppm/°C; PressFit: No; Part Number: R1206_0R005_1%_1W_100PPM_TT_LRMAM1206; Component Kind: Standard; Component Type: Standard; Pin Count: 2; Value: 0R005; Status: Not Recommended; Tolerance: ±1%; Case: 1206; Mounted: Yes; Sense: No; Socket: No; SMD: Yes; ComponentHeight: 0.8mm; HelpURL: \\cern.ch\dfs\Applications\Altium\Datasheets\R1206_TT ELECTRONICS_LRMA.pdf; Author: CERN DEM BC; CreateDate: 29/07/2015; LatestRevisionDate: 29/07/2015
R164 = R1206_0R01_1%_1W_100PPM_TT_LRMAM1206: Resistor - 1%; Part Description: Low Value Metal Alloy Resistor; Manufacturer: TT Electronics; Manufacturer Part Number: LRMAM1206-R01FT5; Power: 1W; TC: ±100ppm/°C; PressFit: No; Part Number: R1206_0R01_1%_1W_100PPM_TT_LRMAM1206; Component Kind: Standard; Component Type: Standard; Pin Count: 2; Value: 0R01; Status: Not Recommended; Tolerance: ±1%; Case: 1206; Mounted: Yes; Sense: No; Socket: No; SMD: Yes; ComponentHeight: 0.8mm; HelpURL: \\cern.ch\dfs\Applications\Altium\Datasheets\R1206_TT ELECTRONICS_LRMA.pdf; Author: CERN DEM BC; CreateDate: 29/07/2015; LatestRevisionDate: 29/07/2015
U1 U3 U6 = CMP-0483-00145-1: Ultralow Noise EMC 36 VIN, 3 A DC/DC uModule Regulator, 76-pin LGA, -40 to 125 degC, Pb-Free, Tray; Manufacturer: Linear Technology; Synchronous: no; Frequency Adjust Range: 200kHz - 2.4MHz; Isupply(mA): 0.075; Extended Temp: E, I, MP; Number of Outputs: 1; Vout Max(V): 24; Vin Max(V): 36; Topology: Buck; Vin Min(V): 3.6; Switch Current(A): 4; Frequency Sync Range: 200kHz - 2MHz; Output Current(A): 3; Vout Min(V): 0.8; Ishutdown(uA): 0.01; Frequency(kHz): 2400; PackageVersion: Rev. A, 01/2013; Tracking: no; ComponentLink3URL: http://cds.linear.com/docs/en/packaging/05081560_A_lga76.pdf; ComponentLink1Description: Manufacturer URL; Code_JEDEC: MO-222; ComponentLink3Description: Package Specification; RoHS: TRUE; PackageDescription: 76-Pin LGA, Body 15 x 11.25 mm, Pitch 1.27 mm; PartNumber: LTM8033IV#PBF; ComponentLink2URL: http://cds.linear.com/docs/en/datasheet/8033f.pdf; Mounting Technology: Surface Mount; ComponentLink1URL: http://www.linear.com/; Packing: Tray; PackageReference: LGA-76; ComponentLink2Description: Datasheet

## Sheet FPGA_RGMII_Misc.SchDoc
size A3
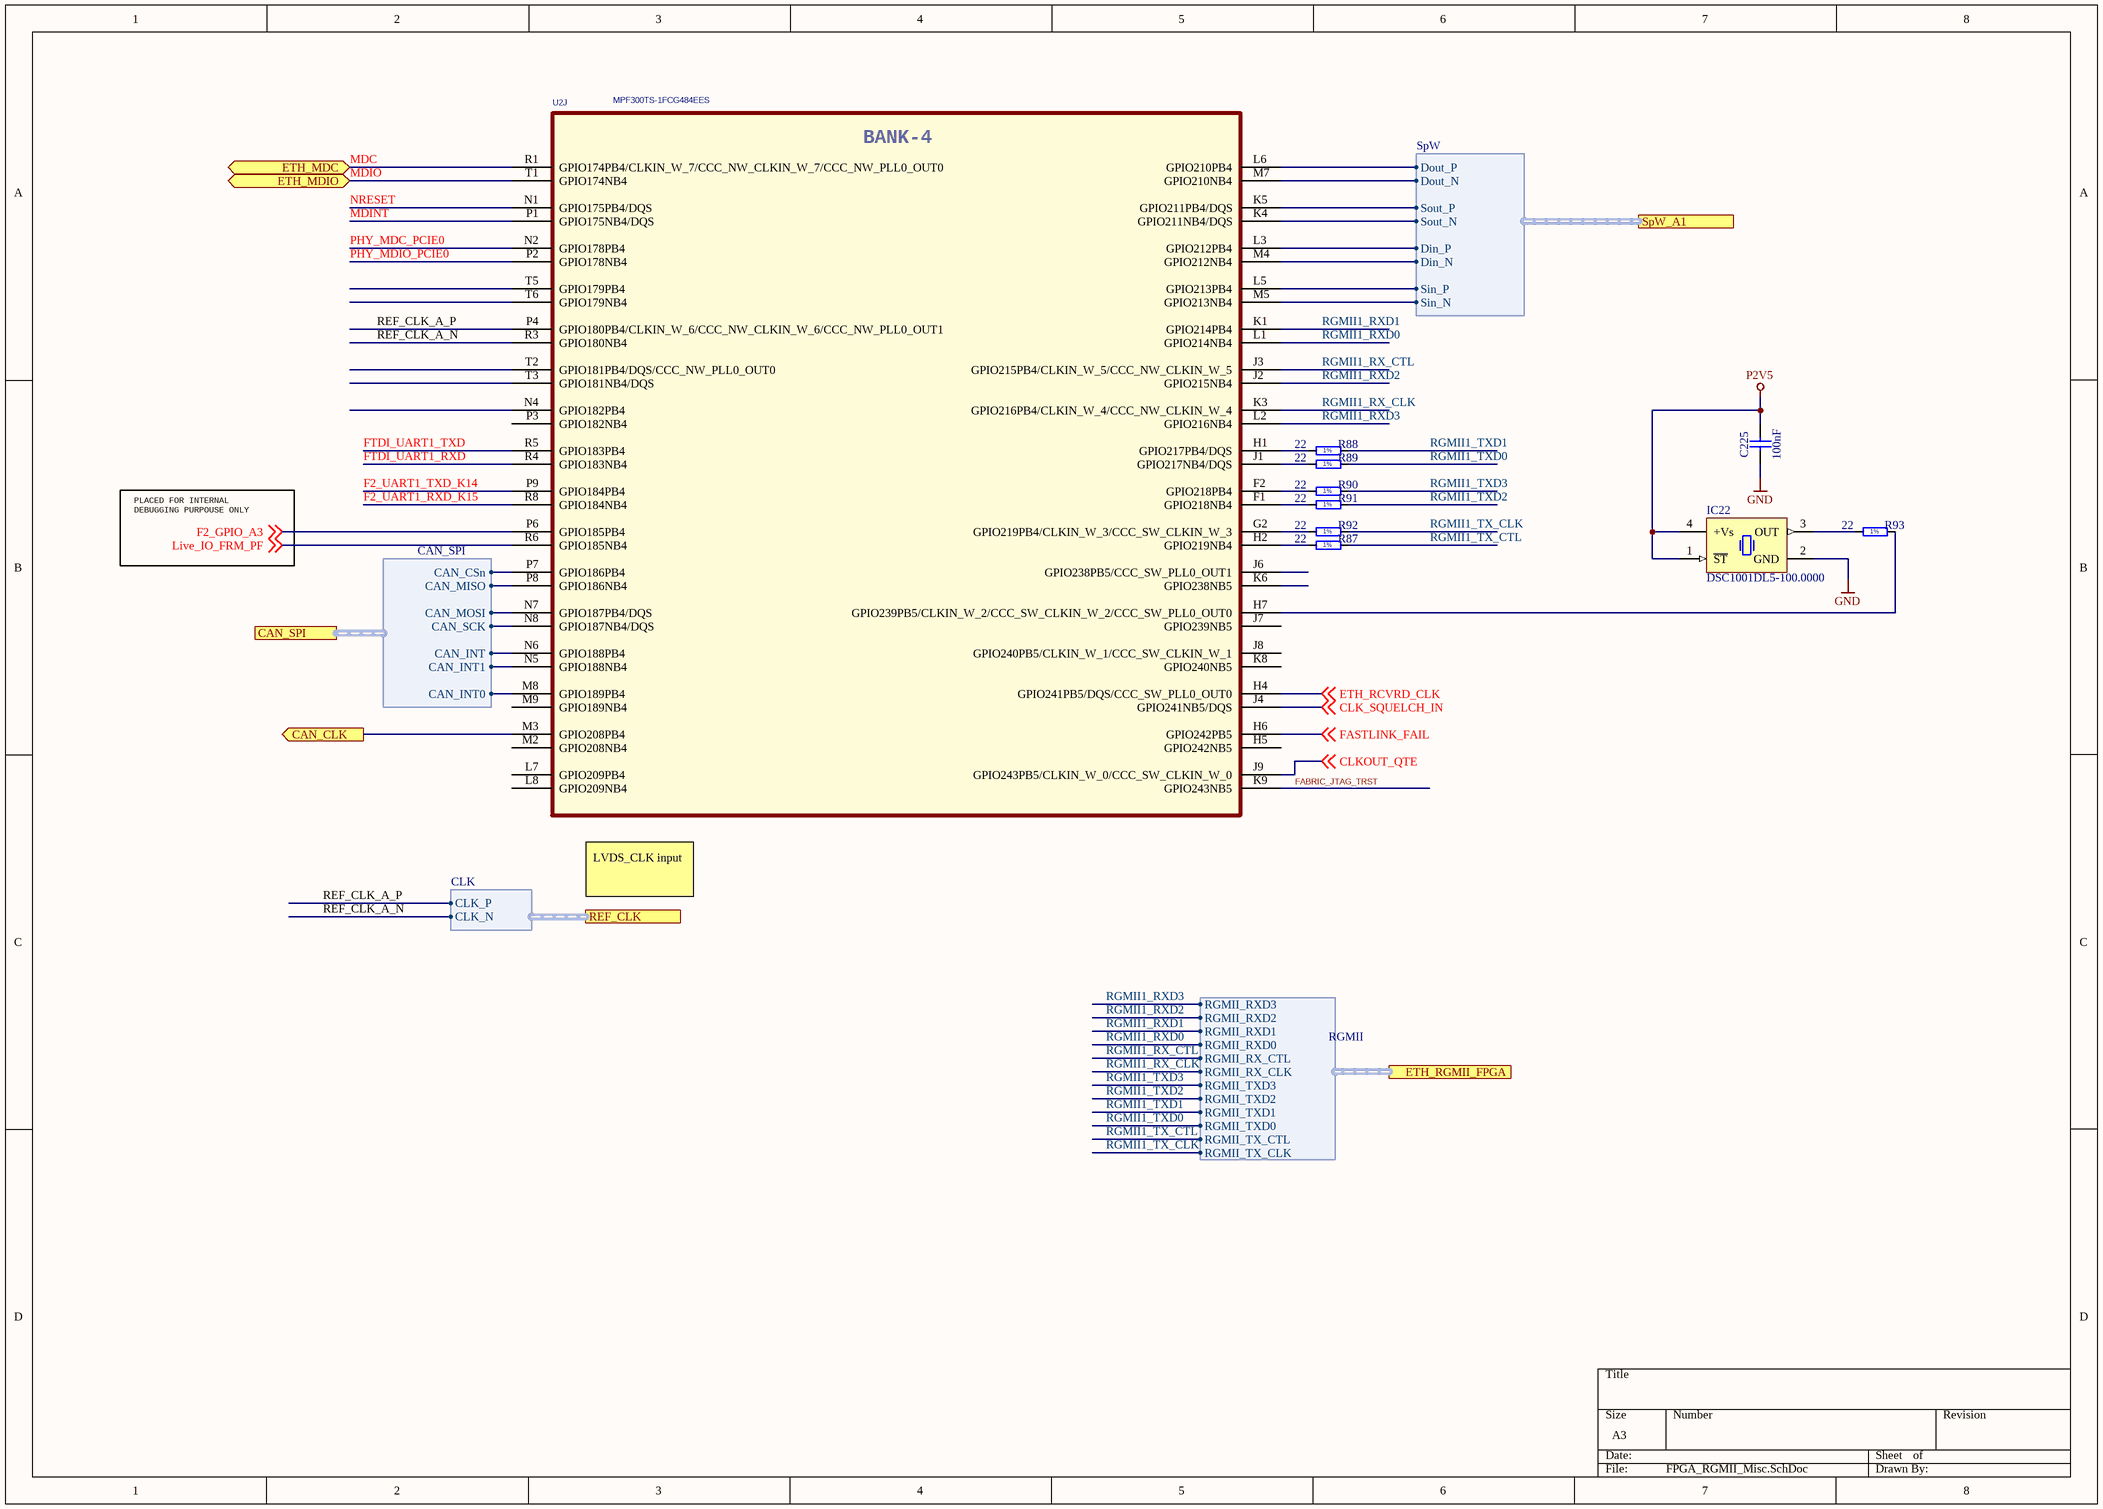
[diagram p2: FPGA_RGMII_Misc.SchDoc]

### Parts
C225  100nF  [CAPC0603X33N]
IC22  DSC1001DL5-100.0000  [OSC_MICREL_2520]
R87  22  [RESC1005X40N]
R88  22  [RESC1005X40N]
R89  22  [RESC1005X40N]
R90  22  [RESC1005X40N]
R91  22  [RESC1005X40N]
R92  22  [RESC1005X40N]
R93  22  [RESC1005X40N]
U2  MPF300TS-1FCG484EES  [BGA484C100P22X22_2300X2300X320]  (part J of 11)

### Ports
CAN_CLK (out), CAN_SPI (harness CAN_SPI), ETH_MDC (bidir), ETH_MDIO (bidir), ETH_RGMII_FPGA (harness RGMII), REF_CLK (harness CLK), SpW_A1 (harness SpW)

### Harnesses
RGMII: RGMII_RXD3, RGMII_RXD2, RGMII_RXD1, RGMII_RXD0, RGMII_RX_CTL, RGMII_RX_CLK, RGMII_TX_CLK, RGMII_TX_CTL, RGMII_TXD3, RGMII_TXD2, RGMII_TXD1, RGMII_TXD0
SpW: Sout_P, Sout_N, Dout_P, Dout_N, Sin_P, Sin_N, Din_P, Din_N
CLK: CLK_P, CLK_N
CAN_SPI: CAN_INT1, CAN_INT, CAN_INT0, CAN_SCK, CAN_MOSI, CAN_MISO, CAN_CSn

### Nets
GND: C225.1 IC22.2(GND)
P2V5: C225.2 IC22.1(~{ST}) IC22.4(+Vs)
CLK_SQUELCH_IN: U2.J4(GPIO241NB5/DQS) ; off-sheet CLK_SQUELCH_IN
CLKOUT_QTE: U2.J9(GPIO243PB5/CLKIN_W_0/CCC_SW_CLKIN_W_0) ; off-sheet CLKOUT_QTE
ETH_RCVRD_CLK: U2.H4(GPIO241PB5/DQS/CCC_SW_PLL0_OUT0) ; off-sheet ETH_RCVRD_CLK
F2_GPIO_A3: U2.P6(GPIO185PB4) ; off-sheet F2_GPIO_A3
F2_UART1_RXD_K15: U2.R8(GPIO184NB4)
F2_UART1_TXD_K14: U2.P9(GPIO184PB4)
FABRIC_JTAG_TRST: U2.K9(GPIO243NB5)
FASTLINK_FAIL: U2.H6(GPIO242PB5) ; off-sheet FASTLINK_FAIL
FTDI_UART1_RXD: U2.R4(GPIO183NB4)
FTDI_UART1_TXD: U2.R5(GPIO183PB4)
Live_IO_FRM_PF: U2.R6(GPIO185NB4) ; off-sheet Live_IO_FRM_PF
MDC: U2.R1(GPIO174PB4/CLKIN_W_7/CCC_NW_CLKIN_W_7/CCC_NW_PLL0_OUT0) ; port ETH_MDC
MDINT: U2.P1(GPIO175NB4/DQS)
MDIO: U2.T1(GPIO174NB4) ; port ETH_MDIO
NRESET: U2.N1(GPIO175PB4/DQS)
PHY_MDC_PCIE0: U2.N2(GPIO178PB4)
PHY_MDIO_PCIE0: U2.P2(GPIO178NB4)
REF_CLK_A_N: U2.R3(GPIO180NB4) ; port REF_CLK.CLK_N
REF_CLK_A_P: U2.P4(GPIO180PB4/CLKIN_W_6/CCC_NW_CLKIN_W_6/CCC_NW_PLL0_OUT1) ; port REF_CLK.CLK_P
RGMII1_RX_CLK: U2.K3(GPIO216PB4/CLKIN_W_4/CCC_NW_CLKIN_W_4) ; port ETH_RGMII_FPGA.RGMII_RX_CLK
RGMII1_RX_CTL: U2.J3(GPIO215PB4/CLKIN_W_5/CCC_NW_CLKIN_W_5) ; port ETH_RGMII_FPGA.RGMII_RX_CTL
RGMII1_RXD0: U2.L1(GPIO214NB4) ; port ETH_RGMII_FPGA.RGMII_RXD0
RGMII1_RXD1: U2.K1(GPIO214PB4) ; port ETH_RGMII_FPGA.RGMII_RXD1
RGMII1_RXD2: U2.J2(GPIO215NB4) ; port ETH_RGMII_FPGA.RGMII_RXD2
RGMII1_RXD3: U2.L2(GPIO216NB4) ; port ETH_RGMII_FPGA.RGMII_RXD3
RGMII1_TX_CLK: R92.2 ; port ETH_RGMII_FPGA.RGMII_TX_CLK
RGMII1_TX_CTL: R87.2 ; port ETH_RGMII_FPGA.RGMII_TX_CTL
RGMII1_TXD0: R89.2 ; port ETH_RGMII_FPGA.RGMII_TXD0
RGMII1_TXD1: R88.2 ; port ETH_RGMII_FPGA.RGMII_TXD1
RGMII1_TXD2: R91.2 ; port ETH_RGMII_FPGA.RGMII_TXD2
RGMII1_TXD3: R90.2 ; port ETH_RGMII_FPGA.RGMII_TXD3
NetIC22_3: IC22.3(OUT) R93.1
NetR87_1: R87.1 U2.H2(GPIO219NB4)
NetR88_1: R88.1 U2.H1(GPIO217PB4/DQS)
NetR89_1: R89.1 U2.J1(GPIO217NB4/DQS)
NetR90_1: R90.1 U2.F2(GPIO218PB4)
NetR91_1: R91.1 U2.F1(GPIO218NB4)
NetR92_1: R92.1 U2.G2(GPIO219PB4/CLKIN_W_3/CCC_SW_CLKIN_W_3)
NetR93_2: R93.2 U2.H7(GPIO239PB5/CLKIN_W_2/CCC_SW_CLKIN_W_2/CCC_SW_PLL0_OUT0)
NetU2_K4: U2.K4(GPIO211NB4/DQS) ; port SpW_A1.Sout_N
NetU2_K5: U2.K5(GPIO211PB4/DQS) ; port SpW_A1.Sout_P
NetU2_L3: U2.L3(GPIO212PB4) ; port SpW_A1.Din_P
NetU2_L5: U2.L5(GPIO213PB4) ; port SpW_A1.Sin_P
NetU2_L6: U2.L6(GPIO210PB4) ; port SpW_A1.Dout_P
NetU2_M3: U2.M3(GPIO208PB4) ; port CAN_CLK
NetU2_M4: U2.M4(GPIO212NB4) ; port SpW_A1.Din_N
NetU2_M5: U2.M5(GPIO213NB4) ; port SpW_A1.Sin_N
NetU2_M7: U2.M7(GPIO210NB4) ; port SpW_A1.Dout_N
NetU2_M8: U2.M8(GPIO189PB4) ; port CAN_SPI.CAN_INT0
NetU2_N5: U2.N5(GPIO188NB4) ; port CAN_SPI.CAN_INT1
NetU2_N6: U2.N6(GPIO188PB4) ; port CAN_SPI.CAN_INT
NetU2_N7: U2.N7(GPIO187PB4/DQS) ; port CAN_SPI.CAN_MOSI
NetU2_N8: U2.N8(GPIO187NB4/DQS) ; port CAN_SPI.CAN_SCK
NetU2_P7: U2.P7(GPIO186PB4) ; port CAN_SPI.CAN_CSn
NetU2_P8: U2.P8(GPIO186NB4) ; port CAN_SPI.CAN_MISO

Not connected (* = marked no-connect by the designer): U2 H5(GPIO242NB5) J6(GPIO238PB5/CCC_SW_PLL0_OUT1) J7(GPIO239NB5) J8(GPIO240PB5/CLKIN_W_1/CCC_SW_CLKIN_W_1) K6(GPIO238NB5) K8(GPIO240NB5) L7(GPIO209PB4) L8(GPIO209NB4) M2(GPIO208NB4) M9(GPIO189NB4) N4(GPIO182PB4) P3(GPIO182NB4) T2(GPIO181PB4/DQS/CCC_NW_PLL0_OUT0) T3(GPIO181NB4/DQS) T5(GPIO179PB4) T6(GPIO179NB4)

### Notes on the sheet
- PLACED FOR INTERNAL
  DEBUGGING PURPOUSE ONLY
- LVDS_CLK input
- (in symbol FPGA_MPF300T-FCG484, part J) BANK-4
- (in symbol R0402_22R_1%_0.0625W_100PPM) 1%

### Library data of the parts
C225 = CC0201_100NF_6.3V_10%_X5R: Non-polarised capacitor; Manufacturer: GENERIC; Part Description: SMD Multilayer Chip Ceramic Capacitor; Manufacturer1 Part Number: 02016D104KAT2A; Voltage: 6.3V; TC: X5R; Tolerance: ±10%; Part Number: CC0201_100NF_6.3V_10%_X5R; Component Kind: Standard; Component Type: Standard; Pin Count: 2; Value: 100nF; Status: Not Recommended; Manufacturer Part Number: CC0201_100NF_6.3V_10%_X5R; Case: 0201; Mounted: Yes; Socket: No; SMD: Yes; Sense: No; Manufacturer1 Example: AVX; Manufacturer1 ComponentHeight: 0.33mm; HelpURL: \\cern.ch\dfs\Applications\Altium\Datasheets\CC0201_X5R_AVX.pdf; Author: CERN DEM JLC; CreateDate: 03/12/2007; LatestRevisionDate: 03/12/2007
IC22 = OSC_DSC1001DL5-100.0000: MEMS 100MHz oscillator; Manufacturer: Micrel; Part Description: MEMS Oscillator 100MHz; Bonding: No; PressFit: No; Case: *; Component Kind: Standard; Component Type: Standard; ComponentHeigth: *; CreateDate: 2018-01-01; Device: DSC1001DL5-100.0000; Footprint: *; HelpURL: *; LatestRevisionDate: 2018-01-01; Manufacturer Part Number: DSC1001DL5-100.0000; Mounted: Yes; PackageDescription: MICREL SMD Oscillator, QFN, 4 pins, 2.5mm x 2.0mm; Part Number: DSC1001DL5-100.0000; Pin Count: 4; Sense: No; SMD: Yes; Socket: No; Value: *
R87-R93 = R0402_22R_1%_0.0625W_100PPM: Resistor - 1%; Part Description: General Purpose Thick Film Chip Resistor; Manufacturer: GENERIC; Manufacturer1 Part Number: 232270672209L; TC: ±100ppm/°C; PressFit: No; Part Number: R0402_22R_1%_0.0625W_100PPM; Component Kind: Standard; Component Type: Standard; Pin Count: 2; Value: 22; Status: Not Recommended; Power: 0.0625W; Tolerance: ±1%; Manufacturer Part Number: R0402_22R_1%_0.0625W_100PPM; Case: 0402; Mounted: Yes; Sense: No; Socket: No; SMD: Yes; Manufacturer1 Example: YAGEO PHYCOMP; Manufacturer1 ComponentHeight: 0.4mm; HelpURL: \\cern.ch\dfs\Applications\Altium\Datasheets\R0402_Phycomp_RC0402.pdf; Author: CERN DEM JLC; CreateDate: 03/12/2007; LatestRevisionDate: 17/10/2012
U2 = FPGA_MPF300T-FCG484: FCG484,23mmX23mm,1.0mm pitch; Manufacturer: Microsemi; Part Number: MPF300TS-1FCG484I

## Nets that join several sheets
GND: Channel_supply (58 pins), FPGA_RGMII_Misc (C225.1 IC22.2)
P2V5: Channel_supply (6 pins), FPGA_RGMII_Misc (C225.2 IC22.1 IC22.4)